# Altium project DAL_OBC_V10.PrjPcb (part 9 of 9)

## Sheet FPGA_CONN_OUT.SchDoc
size 420 x 297 mm; SheetNumber: 31; SheetTotal: 34
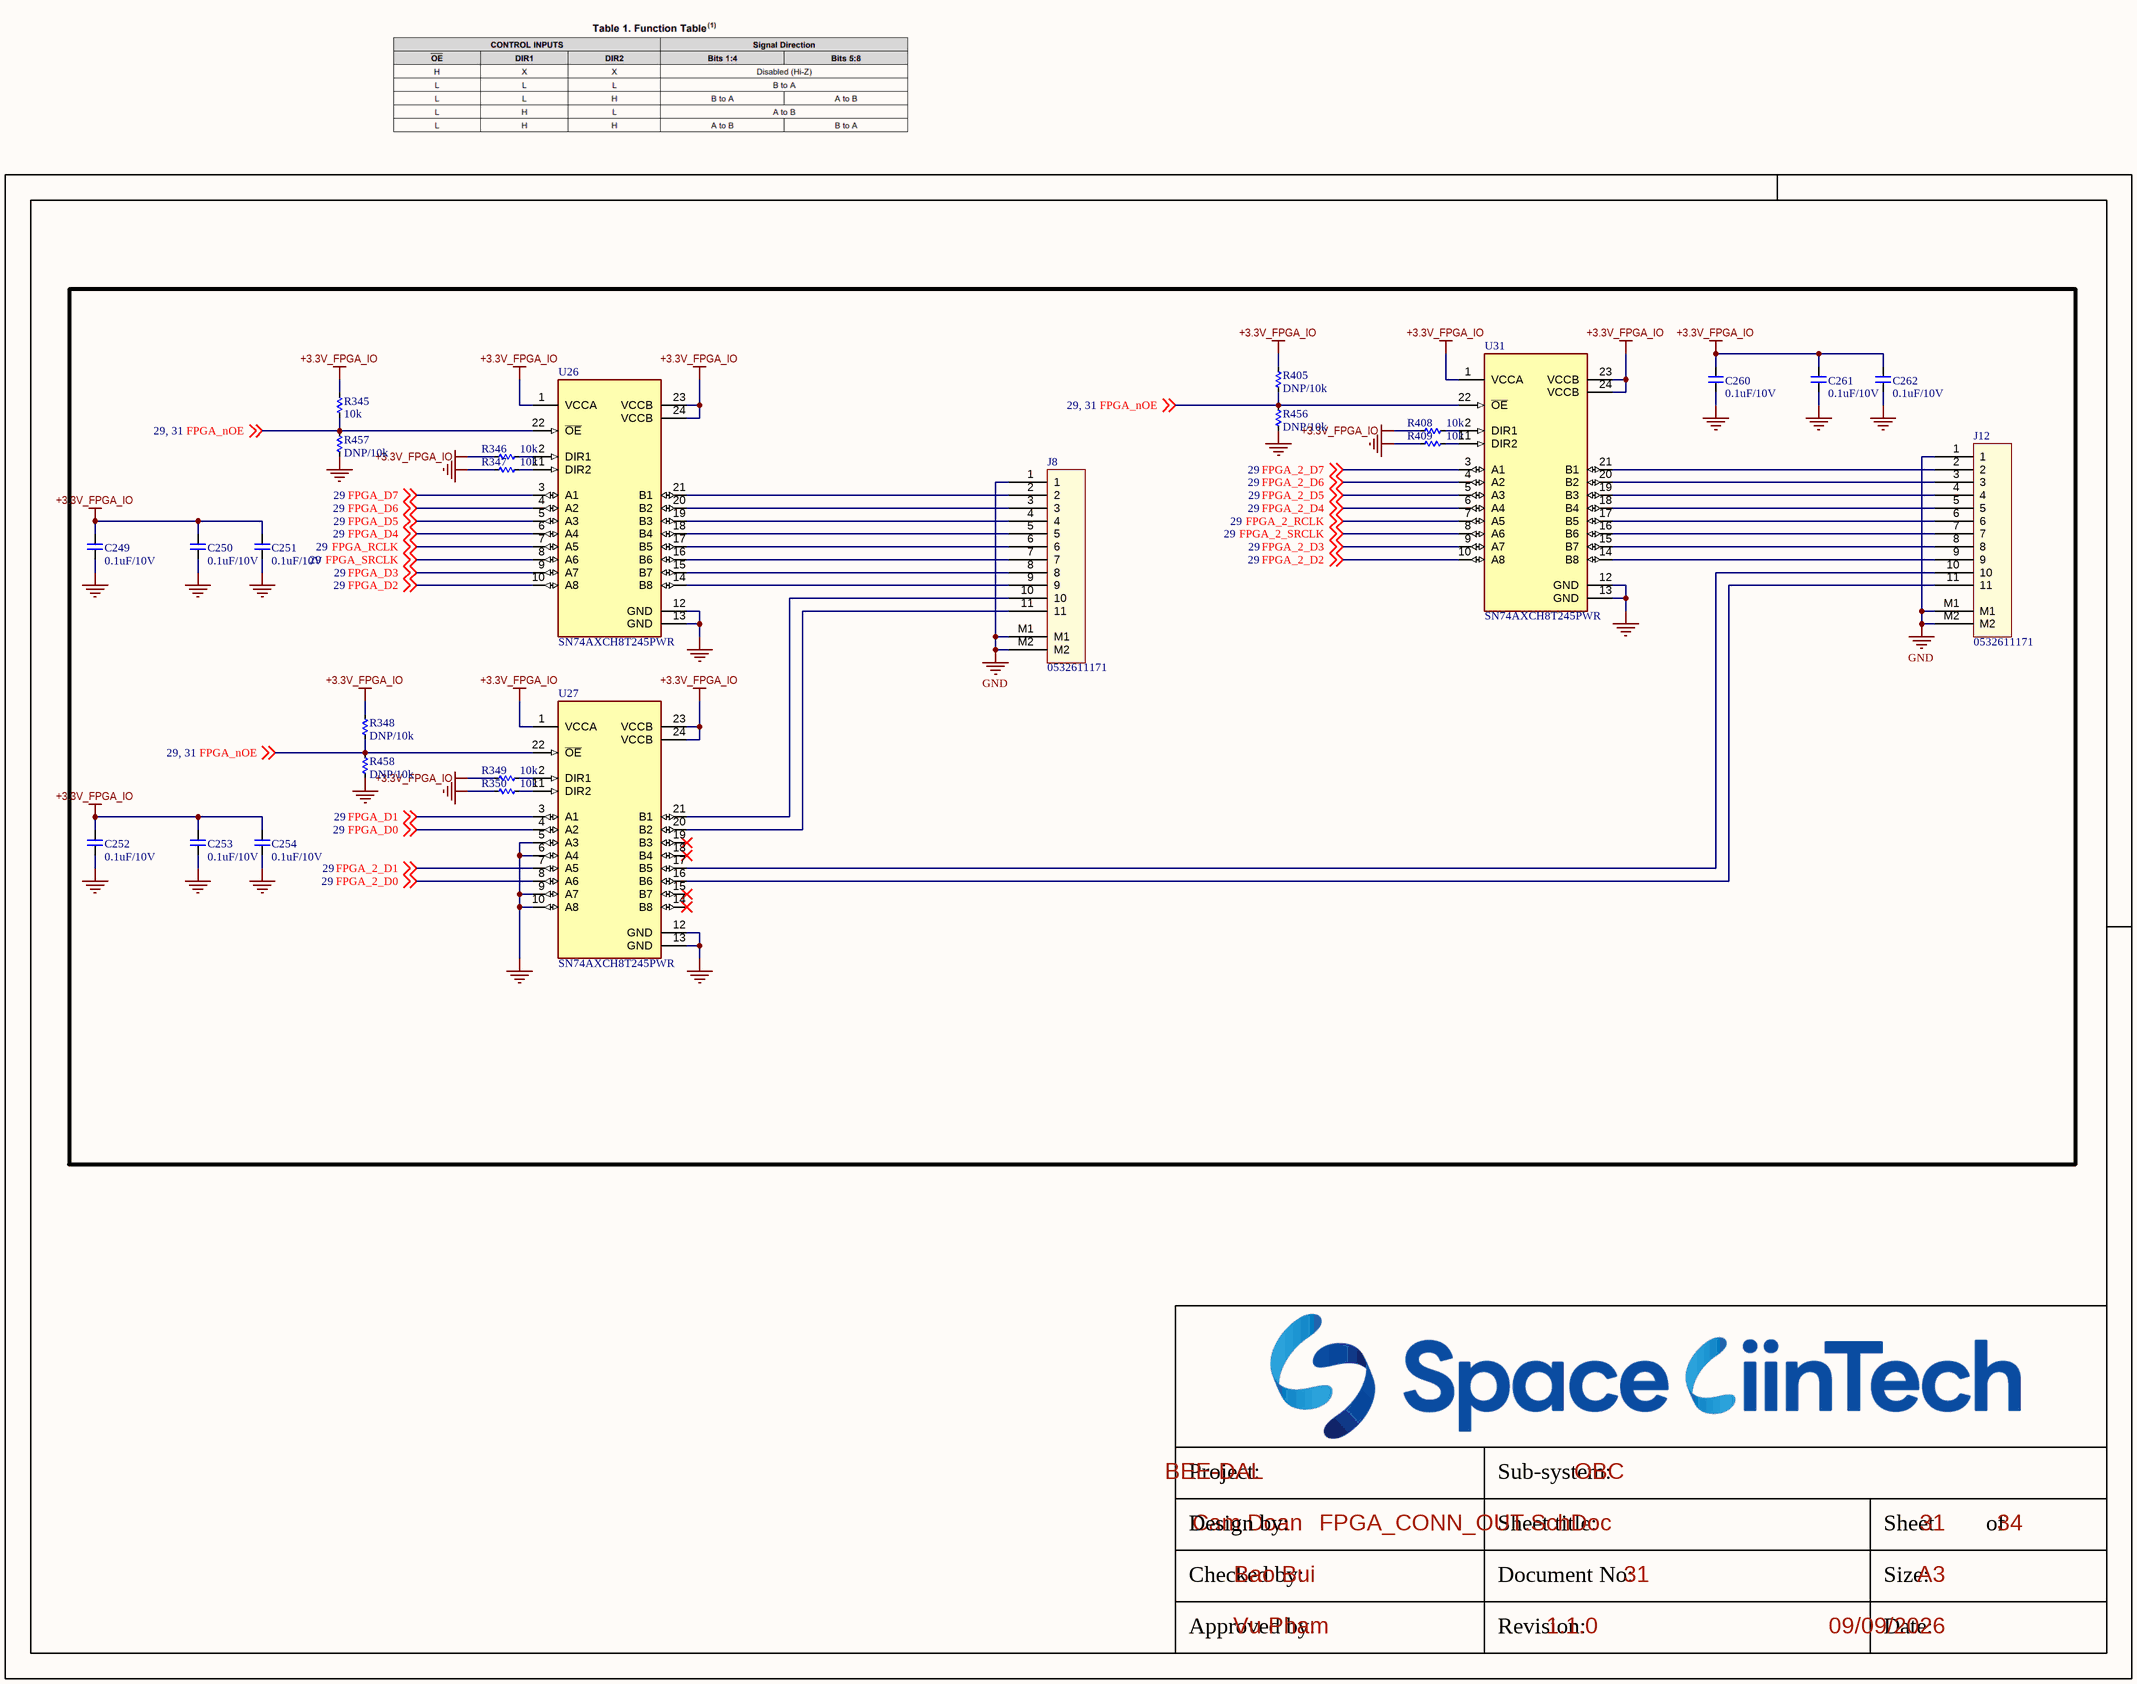
[diagram p32: FPGA_CONN_OUT.SchDoc]

### Parts
C249  0.1uF/10V  [CAP_C_1005X50_L]
C250  0.1uF/10V  [CAP_C_1005X50_L]
C251  0.1uF/10V  [CAP_C_1005X50_L]
C252  0.1uF/10V  [CAP_C_1005X50_L]
C253  0.1uF/10V  [CAP_C_1005X50_L]
C254  0.1uF/10V  [CAP_C_1005X50_L]
C260  0.1uF/10V  [CAP_C_1005X50_L]
C261  0.1uF/10V  [CAP_C_1005X50_L]
C262  0.1uF/10V  [CAP_C_1005X50_L]
J8  0532611171  [MOLEX_0532611171]
J12  0532611171  [MOLEX_0532611171]
R345  10k  [RES_C_1005x30_L]
R346  10k  [RES_C_1005x30_L]
R347  10k  [RES_C_1005x30_L]
R348  DNP/10k  [RES_C_1005x30_L]
R349  10k  [RES_C_1005x30_L]
R350  10k  [RES_C_1005x30_L]
R405  DNP/10k  [RES_C_1005x30_L]
R408  10k  [RES_C_1005x30_L]
R409  10k  [RES_C_1005x30_L]
R456  DNP/10k  [RES_C_1005x30_L]
R457  DNP/10k  [RES_C_1005x30_L]
R458  DNP/10k  [RES_C_1005x30_L]
U26  SN74AXCH8T245PWR  [SOP65P640X120-24N]
U27  SN74AXCH8T245PWR  [SOP65P640X120-24N]
U31  SN74AXCH8T245PWR  [SOP65P640X120-24N]

### Nets
+3.3V_FPGA_IO: C249.2 C250.2 C251.2 C252.2 C253.2 C254.2 C260.2 C261.2 C262.2 R345.1 R346.1 R348.1 R349.1 R405.1 R408.1 U26.1(VCCA) U26.23(VCCB) U26.24(VCCB) U27.1(VCCA) U27.23(VCCB) U27.24(VCCB) U31.1(VCCA) U31.23(VCCB) U31.24(VCCB)
GND: C249.1 C250.1 C251.1 C252.1 C253.1 C254.1 C260.1 C261.1 C262.1 J8.1 J8.M1 J8.M2 J12.1 J12.M1 J12.M2 R347.1 R350.1 R409.1 R456.2 R457.2 R458.2 U26.12(GND) U26.13(GND) U27.5(A3) U27.6(A4) U27.9(A7) U27.10(A8) U27.12(GND) U27.13(GND) U31.12(GND) U31.13(GND)  [project net AGND]
FPGA_2_D0: U27.8(A6) ; off-sheet FPGA_2_D0
FPGA_2_D1: U27.7(A5) ; off-sheet FPGA_2_D1
FPGA_2_D2: U31.10(A8) ; off-sheet FPGA_2_D2
FPGA_2_D3: U31.9(A7) ; off-sheet FPGA_2_D3
FPGA_2_D4: U31.6(A4) ; off-sheet FPGA_2_D4
FPGA_2_D5: U31.5(A3) ; off-sheet FPGA_2_D5
FPGA_2_D6: U31.4(A2) ; off-sheet FPGA_2_D6
FPGA_2_D7: U31.3(A1) ; off-sheet FPGA_2_D7
FPGA_2_RCLK: U31.7(A5) ; off-sheet FPGA_2_RCLK
FPGA_2_SRCLK: U31.8(A6) ; off-sheet FPGA_2_SRCLK
FPGA_D0: U27.4(A2) ; off-sheet FPGA_D0
FPGA_D1: U27.3(A1) ; off-sheet FPGA_D1
FPGA_D2: U26.10(A8) ; off-sheet FPGA_D2
FPGA_D3: U26.9(A7) ; off-sheet FPGA_D3
FPGA_D4: U26.6(A4) ; off-sheet FPGA_D4
FPGA_D5: U26.5(A3) ; off-sheet FPGA_D5
FPGA_D6: U26.4(A2) ; off-sheet FPGA_D6
FPGA_D7: U26.3(A1) ; off-sheet FPGA_D7
FPGA_nOE: R345.2 R348.2 R405.2 R456.1 R457.1 R458.1 U26.22(~{OE}) U27.22(~{OE}) U31.22(~{OE}) ; off-sheet FPGA_nOE
FPGA_RCLK: U26.7(A5) ; off-sheet FPGA_RCLK
FPGA_SRCLK: U26.8(A6) ; off-sheet FPGA_SRCLK
NetJ8_2: J8.2 U26.21(B1)
NetJ8_3: J8.3 U26.20(B2)
NetJ8_4: J8.4 U26.19(B3)
NetJ8_5: J8.5 U26.18(B4)
NetJ8_6: J8.6 U26.17(B5)
NetJ8_7: J8.7 U26.16(B6)
NetJ8_8: J8.8 U26.15(B7)
NetJ8_9: J8.9 U26.14(B8)
NetJ8_10: J8.10 U27.21(B1)
NetJ8_11: J8.11 U27.20(B2)
NetJ12_2: J12.2 U31.21(B1)
NetJ12_3: J12.3 U31.20(B2)
NetJ12_4: J12.4 U31.19(B3)
NetJ12_5: J12.5 U31.18(B4)
NetJ12_6: J12.6 U31.17(B5)
NetJ12_7: J12.7 U31.16(B6)
NetJ12_8: J12.8 U31.15(B7)
NetJ12_9: J12.9 U31.14(B8)
NetJ12_10: J12.10 U27.17(B5)
NetJ12_11: J12.11 U27.16(B6)
NetR346_2: R346.2 U26.2(DIR1)
NetR347_2: R347.2 U26.11(DIR2)
NetR349_2: R349.2 U27.2(DIR1)
NetR350_2: R350.2 U27.11(DIR2)
NetR408_2: R408.2 U31.2(DIR1)
NetR409_2: R409.2 U31.11(DIR2)

Not connected (* = marked no-connect by the designer): U27 14(B8)* 15(B7)* 18(B4)* 19(B3)*

### Notes on the sheet
- Project:
- Sub-system:
- Design by:
- Sheet title:
- Sheet
- of
- Checked by:
- Approved by:
- Revision:
- Document No:
- Size:
- Date:
- A3

### Library data of the parts
C249-C254 C260-C262 = _CAP_C_2: CAP
J8 J12 = Header 11x1_2M
R345-R350 R405 R408 R409 R456-R458 = _RES_B_2: RES
U26 U27 U31 = IC_voltage_level_SN74AXCH8T245PWR: 8-Bit Dual-Supply Bus Transceiver; MF: Texas Instruments; MP: SN74AXCH8T245PWR; Value: *; Check_prices: https://www.snapeda.com/parts/SN74AXCH8T245PWR/Texas+Instruments/view-part/?ref=eda; SnapEDA_Link: https://www.snapeda.com/parts/SN74AXCH8T245PWR/Texas+Instruments/view-part/?ref=snap; Price: None; Availability: In Stock; Purchase-URL: https://pricing.snapeda.com/search/part/SN74AXCH8T245PWR/?ref=eda; Package: TSSOP-24 Texas Instruments

## Sheet ChangeNote.SchDoc
size 420 x 297 mm; SheetNumber: 32; SheetTotal: 34

### Notes on the sheet
- Project:
- Sub-system:
- Design by:
- Sheet title:
- Sheet
- of
- Checked by:
- Approved by:
- Revision:
- Document No:
- Size:
- Date:
- A3

## Sheet MIPI_CSI.SchDoc
size 420 x 297 mm; SheetNumber: 33; SheetTotal: 34
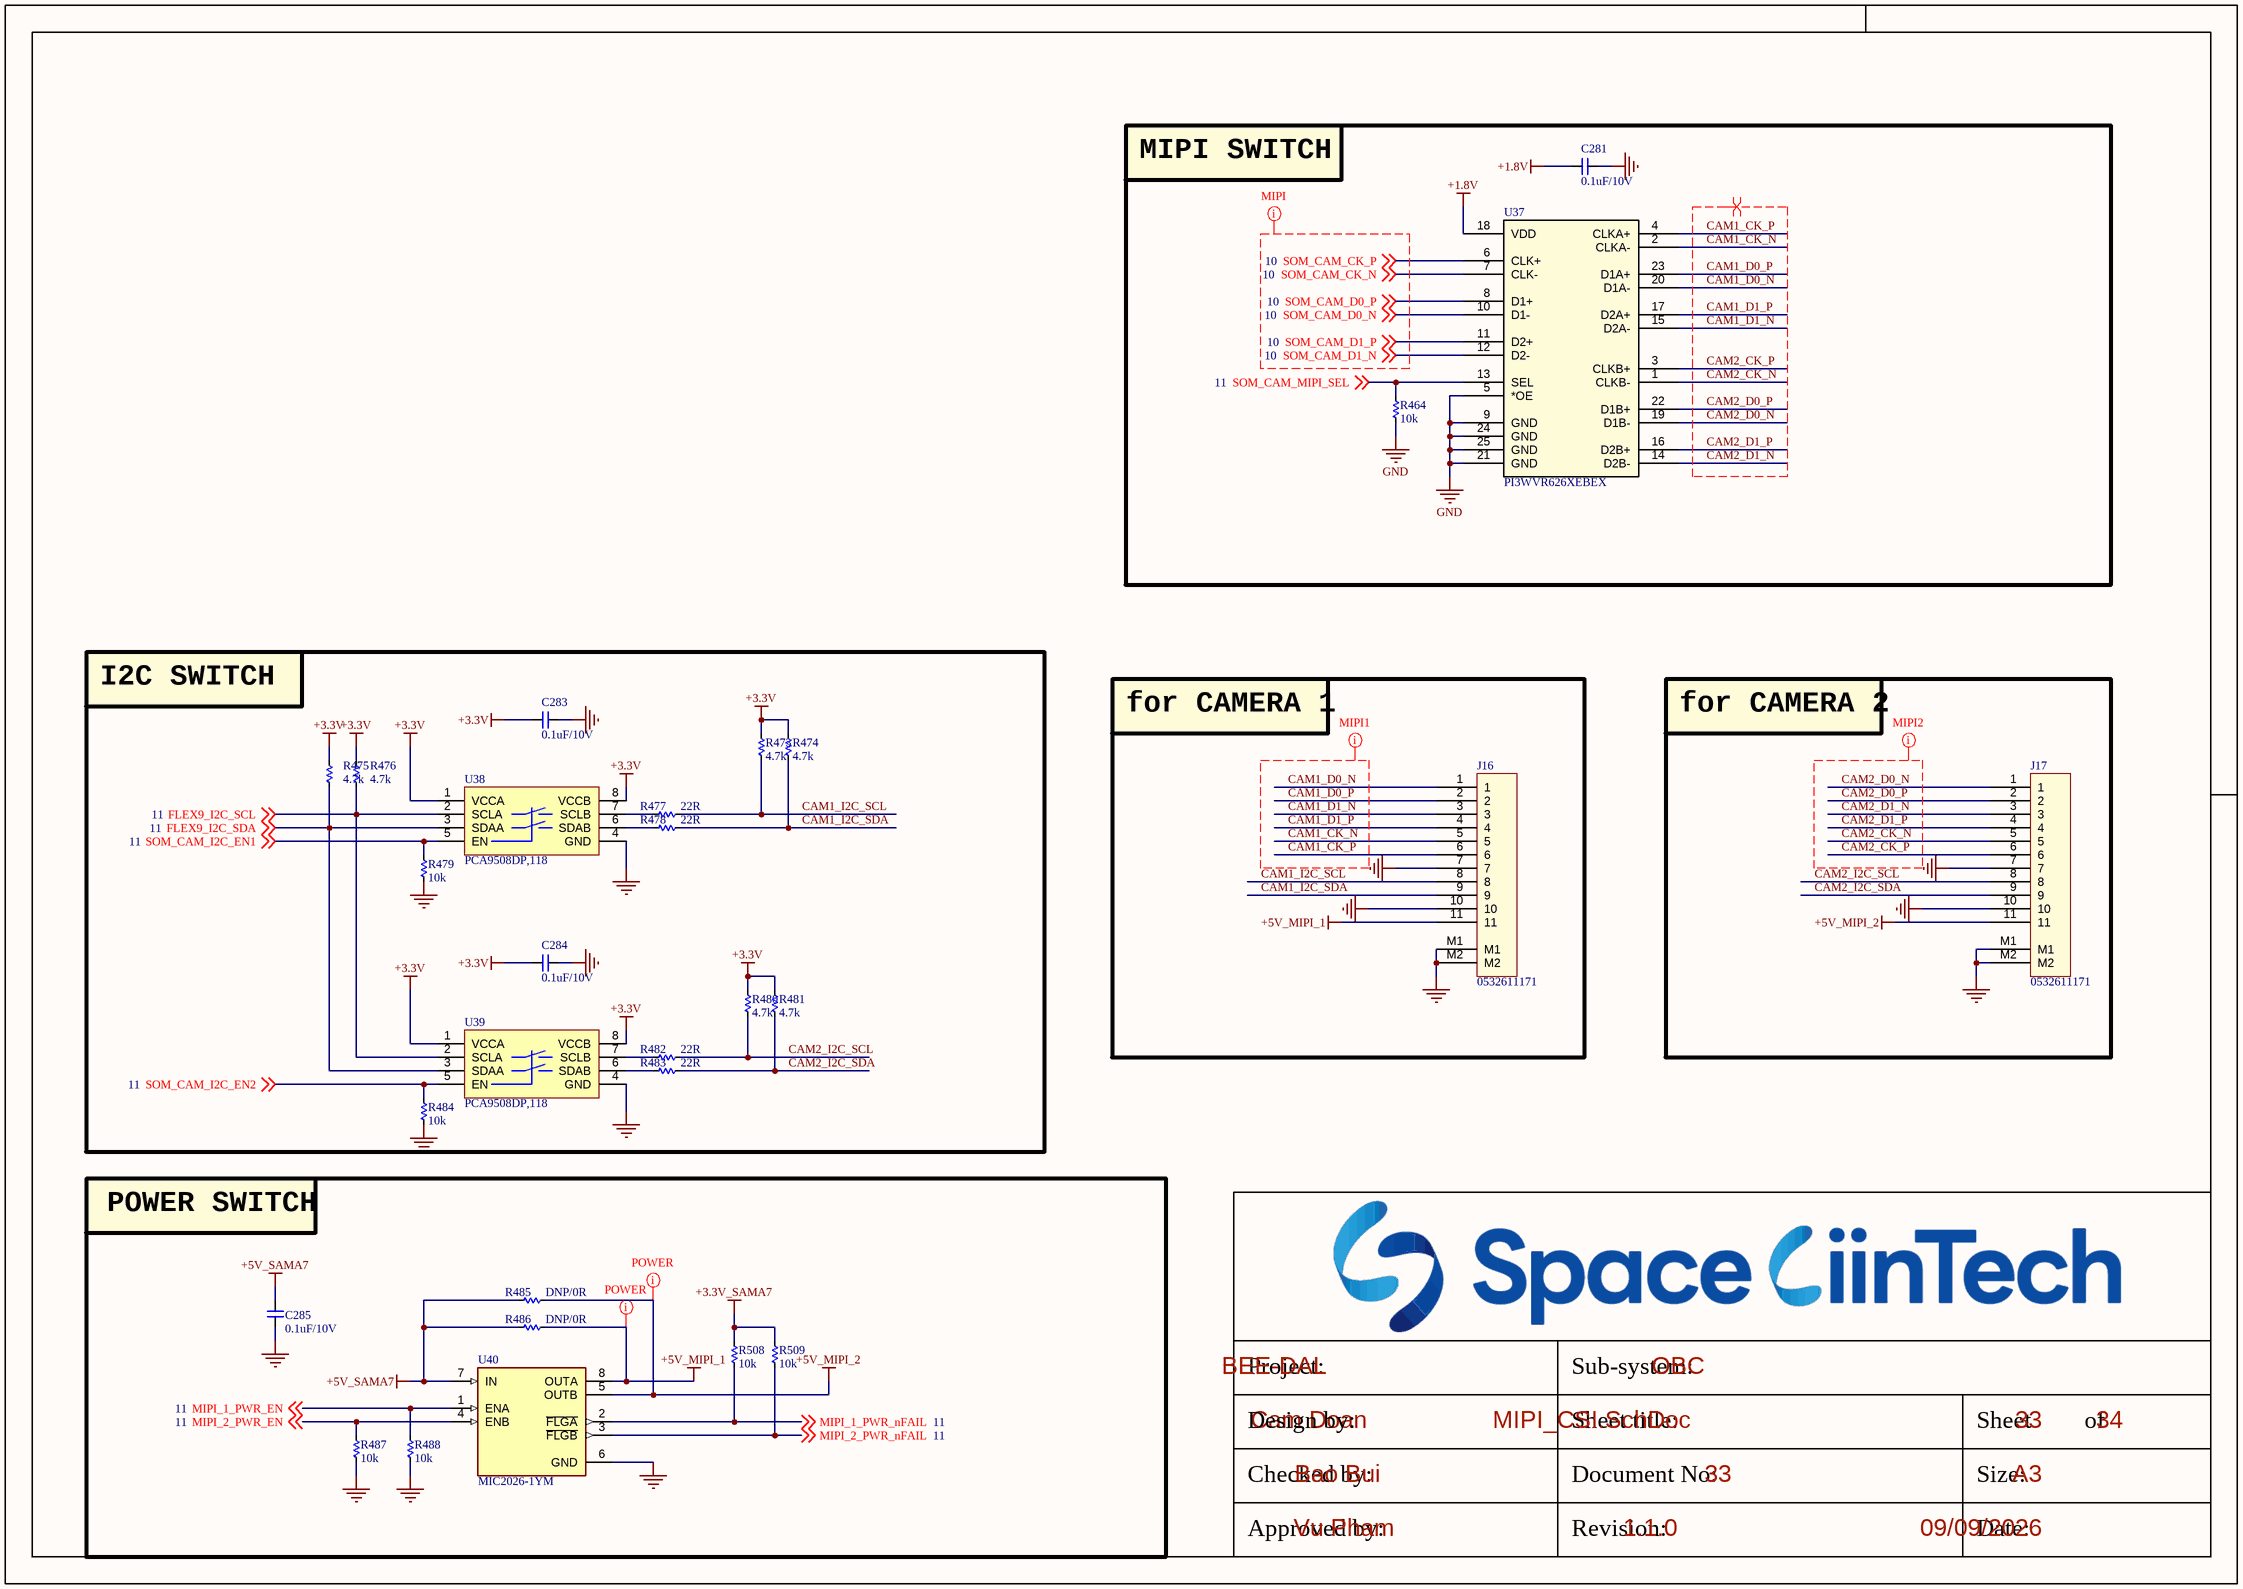
[diagram p33: MIPI_CSI.SchDoc]

### Parts
C281  0.1uF/10V  [CAP_C_1005X50_L]
C283  0.1uF/10V  [CAP_C_1005X50_L]
C284  0.1uF/10V  [CAP_C_1005X50_L]
C285  0.1uF/10V  [CAP_C_1005X50_L]
J16  0532611171  [MOLEX_0532611171]
J17  0532611171  [MOLEX_0532611171]
R464  10k  [RES_C_1005X40]
R473  4.7k  [RES_C_1005X40]
R474  4.7k  [RES_C_1005X40]
R475  4.7k  [RES_C_1005X40]
R476  4.7k  [RES_C_1005X40]
R477  22R  [RES_C_1005X40]
R478  22R  [RES_C_1005X40]
R479  10k  [RES_C_1005X40]
R480  4.7k  [RES_C_1005X40]
R481  4.7k  [RES_C_1005X40]
R482  22R  [RES_C_1005X40]
R483  22R  [RES_C_1005X40]
R484  10k  [RES_C_1005X40]
R485  DNP/0R  [RES_C_1005X40]
R486  DNP/0R  [RES_C_1005X40]
R487  10k  [RES_C_1005X40]
R488  10k  [RES_C_1005X40]
R508  10k  [RES_C_1005X40]
R509  10k  [RES_C_1005X40]
U37  PI3WVR626XEBEX  [PI3WVR626XEBEX_DIO]
U38  PCA9508DP,118  [TSOP8]
U39  PCA9508DP,118  [TSOP8]
U40  MIC2026-1YM  [SOIC127P602X173-8N]

### Blocks framed on the sheet
MIPI SWITCH: C281 R464 U37
I2C SWITCH: C283 C284 R473-R484 U38 U39
for CAMERA 1: J16
for CAMERA 2: J17
POWER SWITCH: C285 R485-R488 R508 R509 U40

### Nets
+1.8V: C281.2 U37.18(VDD)
+3.3V: C283.2 C284.2 R473.1 R474.1 R475.1 R476.1 R480.1 R481.1 U38.1(VCCA) U38.8(VCCB) U39.1(VCCA) U39.8(VCCB)
+3.3V_SAMA7: R508.1 R509.1
+5V_MIPI_1: J16.11 R486.1 U40.8(OUTA)
+5V_MIPI_2: J17.11 R485.1 U40.5(OUTB)
+5V_SAMA7: C285.2 R485.2 R486.2 U40.7(IN)
GND: C281.1 C283.1 C284.1 C285.1 J16.7 J16.10 J16.M1 J16.M2 J17.7 J17.10 J17.M1 J17.M2 R464.1 R479.2 R484.2 R487.2 R488.2 U37.5(*OE) U37.9(GND) U37.21(GND) U37.24(GND) U37.25(GND) U38.4(GND) U39.4(GND) U40.6(GND)  [project net AGND]
CAM1_CK_N: J16.5 U37.2(CLKA-)
CAM1_CK_P: J16.6 U37.4(CLKA+)
CAM1_D0_N: J16.1 U37.20(D1A-)
CAM1_D0_P: J16.2 U37.23(D1A+)
CAM1_D1_N: J16.3 U37.15(D2A-)
CAM1_D1_P: J16.4 U37.17(D2A+)
CAM1_I2C_SCL: J16.8 R473.2 R477.2
CAM1_I2C_SDA: J16.9 R474.2 R478.2
CAM2_CK_N: J17.5 U37.1(CLKB-)
CAM2_CK_P: J17.6 U37.3(CLKB+)
CAM2_D0_N: J17.1 U37.19(D1B-)
CAM2_D0_P: J17.2 U37.22(D1B+)
CAM2_D1_N: J17.3 U37.14(D2B-)
CAM2_D1_P: J17.4 U37.16(D2B+)
CAM2_I2C_SCL: J17.8 R480.2 R482.2
CAM2_I2C_SDA: J17.9 R481.2 R483.2
FLEX9_I2C_SCL: R476.2 U38.2(SCLA) U39.2(SCLA) ; off-sheet FLEX9_I2C_SCL
FLEX9_I2C_SDA: R475.2 U38.3(SDAA) U39.3(SDAA) ; off-sheet FLEX9_I2C_SDA
MIPI_1_PWR_EN: R488.1 U40.1(ENA) ; off-sheet MIPI_1_PWR_EN
MIPI_1_PWR_nFAIL: R508.2 U40.2(~{FLGA}) ; off-sheet MIPI_1_PWR_nFAIL
MIPI_2_PWR_EN: R487.1 U40.4(ENB) ; off-sheet MIPI_2_PWR_EN
MIPI_2_PWR_nFAIL: R509.2 U40.3(~{FLGB}) ; off-sheet MIPI_2_PWR_nFAIL
SOM_CAM_CK_N: U37.7(CLK-) ; off-sheet SOM_CAM_CK_N  [project net MIPI_CK_N]
SOM_CAM_CK_P: U37.6(CLK+) ; off-sheet SOM_CAM_CK_P  [project net MIPI_CK_P]
SOM_CAM_D0_N: U37.10(D1-) ; off-sheet SOM_CAM_D0_N  [project net MIPI_D0_N]
SOM_CAM_D0_P: U37.8(D1+) ; off-sheet SOM_CAM_D0_P  [project net MIPI_D0_P]
SOM_CAM_D1_N: U37.12(D2-) ; off-sheet SOM_CAM_D1_N  [project net MIPI_D1_N]
SOM_CAM_D1_P: U37.11(D2+) ; off-sheet SOM_CAM_D1_P  [project net MIPI_D1_P]
SOM_CAM_I2C_EN1: R479.1 U38.5(EN) ; off-sheet SOM_CAM_I2C_EN1
SOM_CAM_I2C_EN2: R484.1 U39.5(EN) ; off-sheet SOM_CAM_I2C_EN2
SOM_CAM_MIPI_SEL: R464.2 U37.13(SEL) ; off-sheet SOM_CAM_MIPI_SEL
NetR477_1: R477.1 U38.7(SCLB)
NetR478_1: R478.1 U38.6(SDAB)
NetR482_1: R482.1 U39.7(SCLB)
NetR483_1: R483.1 U39.6(SDAB)

### Layout directives
differential pair; net class DIFF100; differential pair class DIFF100: CAM1_CK_N, CAM1_CK_P, CAM1_D0_N, CAM1_D0_P, CAM1_D1_N, CAM1_D1_P, CAM2_CK_N, CAM2_CK_P, CAM2_D0_N, CAM2_D0_P, CAM2_D1_N, CAM2_D1_P
net class POWER: +5V_MIPI_1, +5V_MIPI_2
net class MIPI: SOM_CAM_CK_N, SOM_CAM_CK_P, SOM_CAM_D0_N, SOM_CAM_D0_P, SOM_CAM_D1_N, SOM_CAM_D1_P
net class MIPI1: CAM1_CK_N, CAM1_CK_P, CAM1_D0_N, CAM1_D0_P, CAM1_D1_N, CAM1_D1_P
net class MIPI2: CAM2_CK_N, CAM2_CK_P, CAM2_D0_N, CAM2_D0_P, CAM2_D1_N, CAM2_D1_P

### Notes on the sheet
- Project:
- Sub-system:
- Design by:
- Sheet title:
- Sheet
- of
- Checked by:
- Approved by:
- Revision:
- Document No:
- Size:
- Date:
- A3

### Library data of the parts
C281 C283 C284 = _CAP_C_2: CAP CHIP
C285 = _CAP_C_2: CAP
J16 J17 = Header 11x1_2M
R464 R473-R488 R508 R509 = _RES_B_2: RES
U37 = PI3WVR626XEBEX: Mfr_Name: Diodes Inc; RefDes: RefDes; Type: Type
U40 = IC_PWRSW_MIC2026-1YM: Power Switch/Driver 1:2 N-Channel 1.25A 8-SOIC; MF: Microchip; SnapEDA_Link: https://www.snapeda.com/parts/MIC2026-1YM/Microchip/view-part/?ref=snap; Package: SO-8 Microchip; Value: *; MP: MIC2026-1YM; Check_prices: https://www.snapeda.com/parts/MIC2026-1YM/Microchip/view-part/?ref=eda

## Sheet NTC.SchDoc
size 420 x 297 mm; SheetNumber: 34; SheetTotal: 34
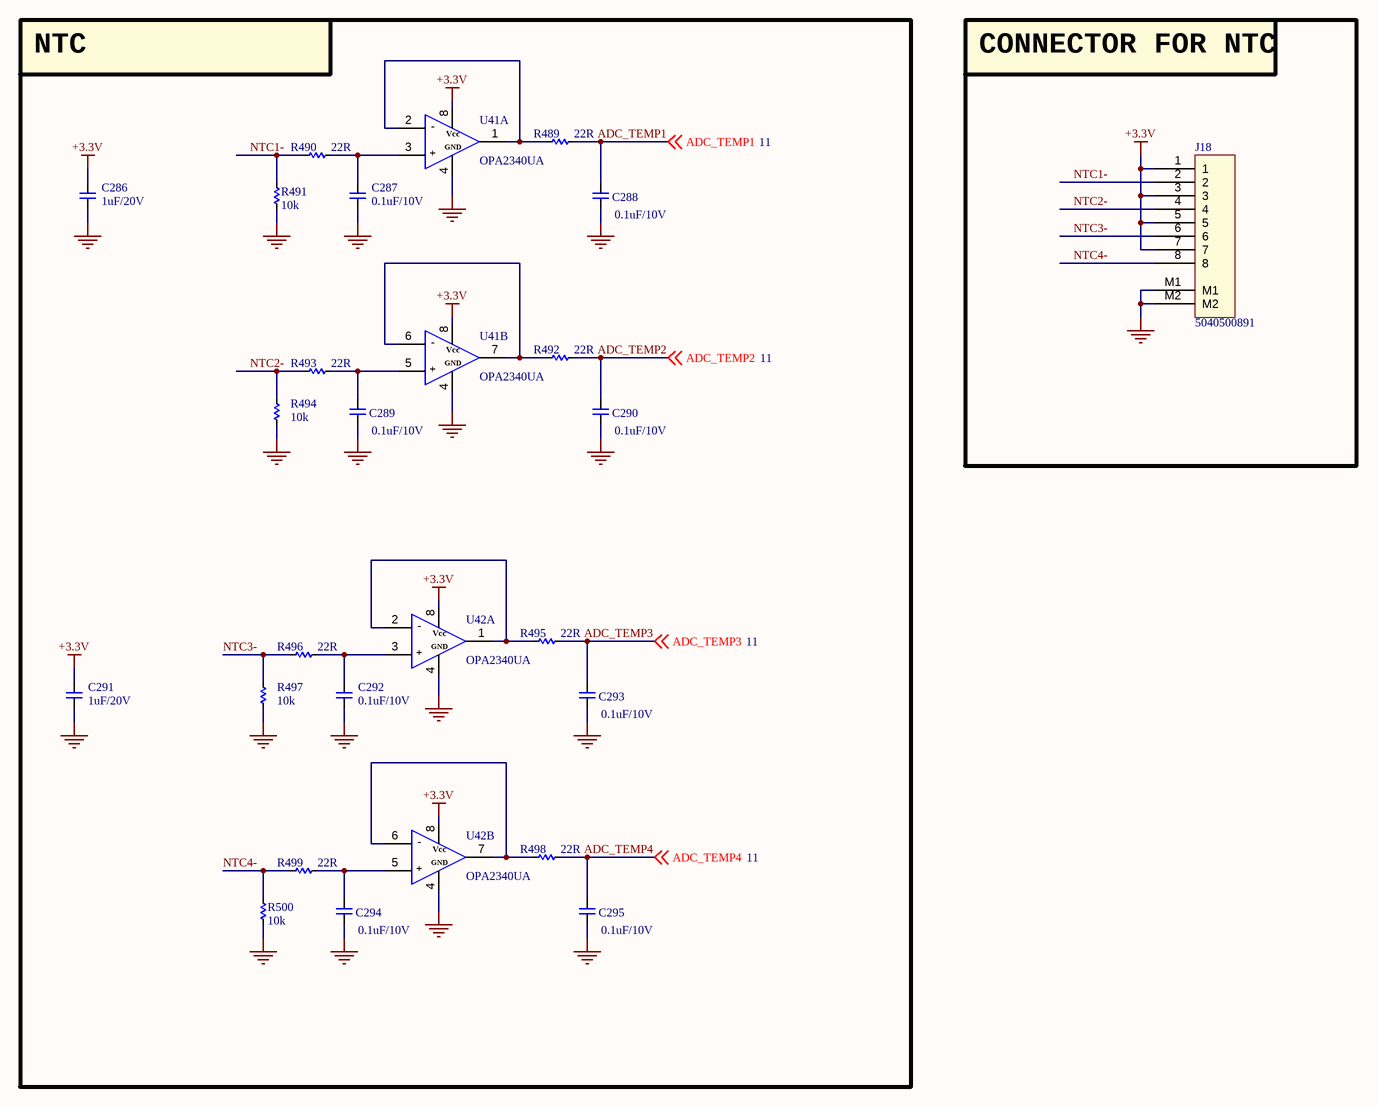
[diagram p34: NTC.SchDoc]

### Parts
C286  1uF/20V  [CAP_C_1005X60]
C287  0.1uF/10V  [CAP_C_1005X50_L]
C288  0.1uF/10V  [CAP_C_1005X50_L]
C289  0.1uF/10V  [CAP_C_1005X50_L]
C290  0.1uF/10V  [CAP_C_1005X50_L]
C291  1uF/20V  [CAP_C_1005X60]
C292  0.1uF/10V  [CAP_C_1005X50_L]
C293  0.1uF/10V  [CAP_C_1005X50_L]
C294  0.1uF/10V  [CAP_C_1005X50_L]
C295  0.1uF/10V  [CAP_C_1005X50_L]
J18  5040500891  [MOLEX_5040500891]
R489  22R  [RES_C_1005X40]
R490  22R  [RES_C_1005X40]
R491  10k  [RES_C_1005X40]
R492  22R  [RES_C_1005X40]
R493  22R  [RES_C_1005X40]
R494  10k  [RES_C_1005X40]
R495  22R  [RES_C_1005X40]
R496  22R  [RES_C_1005X40]
R497  10k  [RES_C_1005X40]
R498  22R  [RES_C_1005X40]
R499  22R  [RES_C_1005X40]
R500  10k  [RES_C_1005X40]
U41  OPA2340UA  [SOIC127P602X173-8N]  (parts A,B of 2)
U42  OPA2340UA  [SOIC127P602X173-8N]  (parts A,B of 2)

### Blocks framed on the sheet
NTC: C286-C295 R489-R500 U41 U42
CONNECTOR FOR NTC: J18

### Nets
+3.3V: C286.2 C291.2 J18.1 J18.3 J18.5 J18.7 U41.8 U42.8
GND: C286.1 C287.1 C288.1 C289.1 C290.1 C291.1 C292.1 C293.1 C294.1 C295.1 J18.M1 J18.M2 R491.1 R494.1 R497.1 R500.1 U41.4 U42.4  [project net AGND]
ADC_TEMP1: C288.2 R489.2 ; off-sheet ADC_TEMP1
ADC_TEMP2: C290.2 R492.2 ; off-sheet ADC_TEMP2
ADC_TEMP3: C293.2 R495.2 ; off-sheet ADC_TEMP3
ADC_TEMP4: C295.2 R498.2 ; off-sheet ADC_TEMP4
NTC1-: J18.2 R490.1 R491.2
NTC2-: J18.4 R493.1 R494.2
NTC3-: J18.6 R496.1 R497.2
NTC4-: J18.8 R499.1 R500.2
NetC287_2: C287.2 R490.2 U41.3
NetC289_2: C289.2 R493.2 U41.5
NetC292_2: C292.2 R496.2 U42.3
NetC294_2: C294.2 R499.2 U42.5
NetR489_1: R489.1 U41.1 U41.2
NetR492_1: R492.1 U41.6 U41.7
NetR495_1: R495.1 U42.1 U42.2
NetR498_1: R498.1 U42.6 U42.7

### Notes on the sheet
- Project:
- Sub-system:
- Design by:
- Sheet title:
- Sheet
- of
- Checked by:
- Approved by:
- Revision:
- Document No:
- Size:
- Date:
- A3
- (in symbol OPA2340UA, part A) -; Vcc; GND; +
- (in symbol OPA2340UA, part B) -; Vcc; GND; +

### Library data of the parts
C286-C295 = _CAP_C_2: CAP
J18 = Header 8x1_2M
R489-R500 = _RES_B_2: RES

## Nets that join several sheets
3.3_VBAT: SAMA7G54_MPU (R34.1), RTC (5 pins)
+1.8V: Power (C300.1 U44.5), MIPI_CSI (C281.2 U37.18)
+1.8V_FPGA: FPGA_POWER (6 pins), FPGA_POWER_2 (13 pins)
+1V_FPGA: FPGA_POWER (6 pins), FPGA_POWER_2 (18 pins)
+3.3V: Power (C299.1 R518.2 U44.1), POWER_MANAGER (R103.2), CONNECTOR_BUS (C298.2 R512.1 R513.1 U43.1), DEBUG_CONSOLE (6 pins), TEMP (C139.2 U12.1), RTC (13 pins), WATCHDOG (C155.2 U16.1), CAN_PHY (6 pins), RS485 (C180.2 R226.1 U28.8), RS422 (6 pins), RS232 (C141.2 U35.16), MIPI_CSI (12 pins), NTC (8 pins)
+3.3V_FPGA_IO: FPGA_POWER (9 pins), FPGA_POWER_2 (50 pins), FPGA_BANK (20 pins), FPGA_FLASH_EEPROM (20 pins), FPGA_CONN_OUT (24 pins)
+3.3V_SAMA7: Power (5 pins), CONNECTOR_IN (R316.2), USB_CAMERA (9 pins), MIPI_CSI (R508.1 R509.1)
+3.3V_SENSE: Power (5 pins), POWER_MANAGER (R103.1)
+5V_AI: POWER_MANAGER (R105.2), CONNECTOR_BUS (H2.19 H2.20)
+5V_AI_eFUSE: Power (8 pins), POWER_MANAGER (R105.1)
+5V_FPGA: POWER_MANAGER (R83.2), FPGA_POWER (11 pins)
+5V_FPGA_eFUSE: POWER_MANAGER (R83.1), FPGA_POWER (8 pins)
+5V_MASTER: Power (17 pins), FPGA_POWER (5 pins)
+5V_PC104: Power (5 pins), CONNECTOR_BUS (6 pins)
+5V_SAMA7: Power (5 pins), POWER_MANAGER (R81#1.2), SAMA7G54_PMIC (13 pins), SAMA7G54_PIO (R152.1), USB_CAMERA (JP7.2), DEBUG_CONSOLE (JP6.1), FPGA_POWER (R305.1), MIPI_CSI (C285.2 R485.2 R486.2 U40.7)
+5V_SAMA7_eFUSE: Power (8 pins), POWER_MANAGER (R81#1.1)
+12V_PC104: CONNECTOR_IN (7 pins), CONNECTOR_BUS (H2.23 H2.24)
AGND: Power (46 pins), POWER_MANAGER (6 pins), CONNECTOR_IN (16 pins), CONNECTOR_BUS (10 pins), SAMA7G54_PMIC (30 pins), SAMA7G54_MPU (115 pins), SAMA7G54_PIO (10 pins), SAMA7G54_DDR3L (84 pins), SDCARD_MRAM (13 pins), eMMC (30 pins), USB_CAMERA (46 pins), DEBUG_CONSOLE (13 pins), TEMP (C139.1 C140.1 U12.3), RTC (10 pins), WATCHDOG (C155.1 R216.2 R283.2 U16.2), CAN_PHY (9 pins), RS485 (C180.1 U28.5), RS422 (6 pins), RS232 (C141.1 C144.1 C145.1 U35.15), BUTTON_LED (DS4.1 DS5.1 DS6.1), MOUNTING_HOLE (Hole1.1 Hole2.1 Hole3.1 Hole4.1), FPGA_POWER (38 pins), FPGA_POWER_2 (77 pins), FPGA_BANK (25 pins), FPGA_FLASH_EEPROM (11 pins), FPGA_CONN_OUT (31 pins), MIPI_CSI (25 pins), NTC (18 pins)
VDD_3V3: POWER_MANAGER (11 pins), SAMA7G54_PMIC (18 pins), SAMA7G54_MPU (7 pins), SAMA7G54_PIO (8 pins), SDCARD_MRAM (18 pins), eMMC (38 pins)
VDD_3V3_MPU: SAMA7G54_PMIC (5 pins), SAMA7G54_MPU (36 pins)
VDDCORE: SAMA7G54_PMIC (R12.2 TP3.0), SAMA7G54_MPU (30 pins)
VDDCPU: SAMA7G54_PMIC (R15.2 TP5.0), SAMA7G54_MPU (11 pins)
VDDIODDR: SAMA7G54_PMIC (R18.2 TP10.0), SAMA7G54_DDR3L (73 pins)
_PD09: SAMA7G54_PMIC (R11.1 U1.1), SAMA7G54_PIO (U3.D19)
ADC_TEMP1: SAMA7G54_PIO (R273.1), NTC (C288.2 R489.2)
ADC_TEMP2: SAMA7G54_PIO (R138.1), NTC (C290.2 R492.2)
ADC_TEMP3: SAMA7G54_PIO (R274.1), NTC (C293.2 R495.2)
ADC_TEMP4: SAMA7G54_PIO (R275.1), NTC (C295.2 R498.2)
ADC_TEMP_1: SAMA7G54_PIO (R386.1), TEMP (C140.2 R195.2)
CPU_FPGA_PROGRAM_B: SAMA7G54_PIO (R315.1), FPGA_BANK (R357.1)
FLEX9_I2C_SCL: SAMA7G54_PIO (R142.1), MIPI_CSI (R476.2 U38.2 U39.2)
FLEX9_I2C_SDA: SAMA7G54_PIO (R140.1), MIPI_CSI (R475.2 U38.3 U39.3)
FPGA_2_D0: FPGA_BANK (R392.2), FPGA_CONN_OUT (U27.8)
FPGA_2_D1: FPGA_BANK (R393.2), FPGA_CONN_OUT (U27.7)
FPGA_2_D2: FPGA_BANK (R394.2), FPGA_CONN_OUT (U31.10)
FPGA_2_D3: FPGA_BANK (R395.2), FPGA_CONN_OUT (U31.9)
FPGA_2_D4: FPGA_BANK (R397.2), FPGA_CONN_OUT (U31.6)
FPGA_2_D5: FPGA_BANK (R399.2), FPGA_CONN_OUT (U31.5)
FPGA_2_D6: FPGA_BANK (R398.2), FPGA_CONN_OUT (U31.4)
FPGA_2_D7: FPGA_BANK (R400.2), FPGA_CONN_OUT (U31.3)
FPGA_2_RCLK: FPGA_BANK (R390.2), FPGA_CONN_OUT (U31.7)
FPGA_2_SRCLK: FPGA_BANK (R391.2), FPGA_CONN_OUT (U31.8)
FPGA_CONF_SPI_CLK: FPGA_BANK (R186.2), FPGA_FLASH_EEPROM (U14.6)
FPGA_CONF_SPI_CS: FPGA_BANK (R187.2), FPGA_FLASH_EEPROM (R252.1 U14.3)
FPGA_CONF_SPI_MISO: FPGA_BANK (R192.2), FPGA_FLASH_EEPROM (U14.13)
FPGA_CONF_SPI_MOSI: FPGA_BANK (R189.2), FPGA_FLASH_EEPROM (U14.10)
FPGA_D0: FPGA_BANK (R198.2), FPGA_CONN_OUT (U27.4)
FPGA_D1: FPGA_BANK (R199.2), FPGA_CONN_OUT (U27.3)
FPGA_D2: FPGA_BANK (R188.2), FPGA_CONN_OUT (U26.10)
FPGA_D3: FPGA_BANK (R190.2), FPGA_CONN_OUT (U26.9)
FPGA_D4: FPGA_BANK (R194.2), FPGA_CONN_OUT (U26.6)
FPGA_D5: FPGA_BANK (R196.2), FPGA_CONN_OUT (U26.5)
FPGA_D6: FPGA_BANK (R203.2), FPGA_CONN_OUT (U26.4)
FPGA_D7: FPGA_BANK (R205.2), FPGA_CONN_OUT (U26.3)
FPGA_FLASH_SPI_MCSN: FPGA_BANK (R197.2), FPGA_FLASH_EEPROM (R249.1 U13.3)
FPGA_FLASH_SPI_MD2: FPGA_BANK (R202.2), FPGA_FLASH_EEPROM (R266.1)
FPGA_FLASH_SPI_MD3: FPGA_BANK (R201.2), FPGA_FLASH_EEPROM (R265.2)
FPGA_FLASH_SPI_MISO/MD1: FPGA_BANK (R204.2), FPGA_FLASH_EEPROM (U13.13)
FPGA_FLASH_SPI_MOSI/MD0: FPGA_BANK (R206.2), FPGA_FLASH_EEPROM (U13.10)
FPGA_nOE: FPGA_BANK (R200.2), FPGA_CONN_OUT (9 pins)
FPGA_QSPI_CLK: FPGA_BANK (R243.2 R355.2), FPGA_FLASH_EEPROM (U13.6)
FPGA_RCLK: FPGA_BANK (R191.2), FPGA_CONN_OUT (U26.7)
FPGA_SRCLK: FPGA_BANK (R193.2), FPGA_CONN_OUT (U26.8)
FPGA_USART_CLK: SAMA7G54_PIO (R269.1), FPGA_BANK (U11.P8)
FPGA_USART_RX: SAMA7G54_PIO (R148.1), FPGA_BANK (U11.R8)
FPGA_USART_TX: SAMA7G54_PIO (R147.1), FPGA_BANK (U11.T7)
LPM: SAMA7G54_PMIC (Q1.1 R3.1 R401.1), SAMA7G54_MPU (R402.1)
MCP16502_HPM: SAMA7G54_PMIC (R4.1), SAMA7G54_PIO (R78.1 R152.2 R155.1)
MIPI_1_PWR_EN: SAMA7G54_PIO (R183.1), MIPI_CSI (R488.1 U40.1)
MIPI_1_PWR_nFAIL: SAMA7G54_PIO (R181.1), MIPI_CSI (R508.2 U40.2)
MIPI_2_PWR_EN: SAMA7G54_PIO (R184.1), MIPI_CSI (R487.1 U40.4)
MIPI_2_PWR_nFAIL: SAMA7G54_PIO (R294.1), MIPI_CSI (R509.2 U40.3)
MIPI_CK_N: SAMA7G54_MPU (U3.N20), MIPI_CSI (U37.7)
MIPI_CK_P: SAMA7G54_MPU (U3.N21), MIPI_CSI (U37.6)
MIPI_D0_N: SAMA7G54_MPU (U3.R18), MIPI_CSI (U37.10)
MIPI_D0_P: SAMA7G54_MPU (U3.P18), MIPI_CSI (U37.8)
MIPI_D1_N: SAMA7G54_MPU (U3.R20), MIPI_CSI (U37.12)
MIPI_D1_P: SAMA7G54_MPU (U3.R21), MIPI_CSI (U37.11)
MPU_CANRX0: SAMA7G54_PIO (R127.1), CAN_PHY (U21.4)
MPU_CANRX1: SAMA7G54_PIO (R132.1), CAN_PHY (U22.4)
MPU_CANTX0: SAMA7G54_PIO (R125.1), CAN_PHY (U21.1)
MPU_CANTX1: SAMA7G54_PIO (R130.1), CAN_PHY (U22.1)
MPU_FPGA_IO_0: SAMA7G54_PIO (R370.1), FPGA_BANK (R374.2)
MPU_FPGA_IO_1: SAMA7G54_PIO (R371.1), FPGA_BANK (R375.2)
MPU_FPGA_IO_2: SAMA7G54_PIO (R372.1), FPGA_BANK (R376.2)
MPU_FPGA_IO_3: SAMA7G54_PIO (R373.1), FPGA_BANK (R377.2)
MPU_UART_CONSOLE_RX: SAMA7G54_PIO (R137.1), DEBUG_CONSOLE (J4.3 R281.2 U19.1)
MPU_UART_CONSOLE_TX: SAMA7G54_PIO (R135.1), DEBUG_CONSOLE (J4.2 R282.2 U19.12)
MPU_UART_RS422_RX: SAMA7G54_PIO (R151.1), DEBUG_CONSOLE (U19.5)
MPU_UART_RS422_TX: SAMA7G54_PIO (R149.1), DEBUG_CONSOLE (U19.14)
MPU_USB_LED: SAMA7G54_PIO (R82.1), USB_CAMERA (R419.1 R423.1 R428.1 R431.1)
MPU_USBA_N: SAMA7G54_MPU (U3.B3), DEBUG_CONSOLE (D6.1)
MPU_USBA_P: SAMA7G54_MPU (U3.A3), DEBUG_CONSOLE (D6.3)
MPU_USBB_N: CONNECTOR_BUS (H1.02), SAMA7G54_MPU (U3.B4)
MPU_USBB_P: CONNECTOR_BUS (H1.04), SAMA7G54_MPU (U3.A4)
MPU_USBC_N: SAMA7G54_MPU (U3.B6), USB_CAMERA (U32.3)
MPU_USBC_P: SAMA7G54_MPU (U3.A6), USB_CAMERA (U32.2)
NetC72_1: SAMA7G54_PMIC (U1.24), SAMA7G54_MPU (C72.1 JP3.1)
NetC75_2: SAMA7G54_PMIC (R10.1 U1.2), SAMA7G54_MPU (R37.1 U3.J7), SAMA7G54_PIO (C75.2 R154.1), WATCHDOG (R213.2)
NetH1_21: CONNECTOR_BUS (H1.21), SAMA7G54_PIO (R42.1)
NetH1_22: CONNECTOR_BUS (H1.22), SAMA7G54_PIO (R270.1)
NetH1_23: CONNECTOR_BUS (H1.23), SAMA7G54_PIO (R101.1)
NetH1_25: CONNECTOR_BUS (H1.25), SAMA7G54_PIO (R47.1)
NetH1_27: CONNECTOR_BUS (H1.27), SAMA7G54_PIO (R45.1)
NetH1_37: CONNECTOR_BUS (H1.37), RS485 (R228.1 U28.7)
NetH1_38: CONNECTOR_BUS (H1.38), RS485 (R228.2 U28.6)
NetQ1_3: SAMA7G54_PMIC (Q1.3 R16.2), SAMA7G54_MPU (Y2.1)
NetR7_2: SAMA7G54_PMIC (R7.2 U2.1), SAMA7G54_PIO (R118.1)
NetR48_1: SAMA7G54_PIO (R48.1), RS485 (U28.4)
NetR51_1: SAMA7G54_PIO (R51.1), RS485 (U28.1)
NetR64_1: SAMA7G54_PIO (R64.1), RTC (R209.2 U15.7)
NetR67_1: SAMA7G54_PIO (R67.1), WATCHDOG (R214.2)
NetR79_2: POWER_MANAGER (R79.2 U6.1), SAMA7G54_PIO (R396.1)
NetR111_1: SAMA7G54_PIO (R111.1), WATCHDOG (R215.2)
NetR116_1: SAMA7G54_PIO (R116.1), RTC (R208.2 U15.3)
NetR226_2: SAMA7G54_PIO (R268.1), RS485 (R226.2 U28.2 U28.3)
PC104_CAM_IQR1: CONNECTOR_BUS (H1.47), SAMA7G54_PIO (R271.1)
PC104_CAM_IQR2: CONNECTOR_BUS (H1.49), SAMA7G54_PIO (R272.1)
PC104_CAN_H: CONNECTOR_BUS (H1.03), CAN_PHY (JP13.2 U21.7 U22.7)
PC104_CAN_L: CONNECTOR_BUS (H1.01), CAN_PHY (JP14.1 U21.6 U22.6)
PC104_I2C_EN: CONNECTOR_BUS (R516.1 U43.5), SAMA7G54_PIO (R517.1)
PC104_I2C_IQR1: CONNECTOR_BUS (H1.43), SAMA7G54_PIO (R297.1)
PC104_I2C_IQR2: CONNECTOR_BUS (H1.45), SAMA7G54_PIO (R276.1)
PC104_RS232_1_RX: CONNECTOR_BUS (H1.19), RS232 (R174.2)
PC104_RS232_1_TX: CONNECTOR_BUS (H1.20), RS232 (R177.2)
PC104_RS232_2_RX: CONNECTOR_BUS (H1.39), RS232 (R448.2)
PC104_RS232_2_TX: CONNECTOR_BUS (H1.41), RS232 (R450.2)
PC104_SPI_IQR1: CONNECTOR_BUS (H1.24), SAMA7G54_PIO (R365.1)
PC104_SPI_IQR2: CONNECTOR_BUS (H1.26), SAMA7G54_PIO (R387.1)
POW_ONOFF_AI: Power (R439.2 R443.1 U34.1), SAMA7G54_PIO (R179.1)
POW_ONOFF_FPGA: SAMA7G54_PIO (R43.1), FPGA_POWER (R305.2 R310.1 U30.1)
RS232_1_UART_RX: SAMA7G54_PIO (R141.1), RS232 (R146.1)
RS232_1_UART_TX: SAMA7G54_PIO (R139.1), RS232 (R176.1)
RS232_2_UART_RX: SAMA7G54_PIO (R129.1), RS232 (R447.1)
RS232_2_UART_TX: SAMA7G54_PIO (R131.1), RS232 (R449.1)
RS422_CONSOLE_SEL: CONNECTOR_IN (Q6.3 R316.1), DEBUG_CONSOLE (R277.2 R278.1 U19.10)
RS422_RX: DEBUG_CONSOLE (U19.3), RS422 (R285.2)
RS422_TX: DEBUG_CONSOLE (U19.13), RS422 (R287.2)
RS_422_RX_N: CONNECTOR_IN (J7.9), RS422 (R236.2 SB3.1 U23.10)
RS_422_RX_P: CONNECTOR_IN (J7.8), RS422 (R236.1 SB2.1 U23.11)
RS_422_TX_N: CONNECTOR_IN (J7.7), RS422 (R237.1 SB3.2 U23.9)
RS_422_TX_P: CONNECTOR_IN (J7.6), RS422 (R237.2 SB2.2 U23.8)
SAM7_MRAM_QSPI_CLK: SAMA7G54_PIO (R77.1), SDCARD_MRAM (U29.6)
SAM7_MRAM_QSPI_IO0: SAMA7G54_PIO (R73.1), SDCARD_MRAM (U29.5)
SAM7_MRAM_QSPI_IO1: SAMA7G54_PIO (R71.1), SDCARD_MRAM (U29.2)
SAM7_MRAM_QSPI_IO2: SAMA7G54_PIO (R69.1), SDCARD_MRAM (U29.3)
SAM7_MRAM_QSPI_IO3: SAMA7G54_PIO (R66.1), SDCARD_MRAM (U29.7)
SAM7_MRAM_QSPI_nCS: SAMA7G54_PIO (R75.1), SDCARD_MRAM (R110.1)
SAM_RTC_I2C_SCL: POWER_MANAGER (R54.2 U6.4), CONNECTOR_BUS (R513.2 U43.2), SAMA7G54_PMIC (R1.2 U1.6 U2.4), SAMA7G54_PIO (R121.1), RTC (R211.2 R412.1 U15.4)
SAM_RTC_I2C_SDA: POWER_MANAGER (R57.2 U6.5), CONNECTOR_BUS (R512.2 U43.3), SAMA7G54_PMIC (R2.2 U1.5 U2.5), SAMA7G54_PIO (R120.1), RTC (R212.2 R411.2 U15.5)
SAMA7_CONF_SPI_FPGA_SEL: SAMA7G54_PIO (R87.1), FPGA_FLASH_EEPROM (R253.1 U14.1)
SAMA7_CONF_SPI_MCLK: SAMA7G54_PIO (R95.1), FPGA_FLASH_EEPROM (U14.5)
SAMA7_CONF_SPI_MCSN: SAMA7G54_PIO (R96.1), FPGA_FLASH_EEPROM (R251.1 U14.2)
SAMA7_CONF_SPI_MISO/MD1: SAMA7G54_PIO (R98.1), FPGA_FLASH_EEPROM (U14.14)
SAMA7_CONF_SPI_MOSI/MD0: SAMA7G54_PIO (R97.1), FPGA_FLASH_EEPROM (U14.11)
SAMA7_FLASH_SPI_FPGA_SEL: SAMA7G54_PIO (R85.1), FPGA_FLASH_EEPROM (R250.1 U13.1)
SAMA7_FLASH_SPI_MCLK: SAMA7G54_PIO (R56.1), FPGA_FLASH_EEPROM (U13.5)
SAMA7_FLASH_SPI_MCSN: SAMA7G54_PIO (R59.1), FPGA_FLASH_EEPROM (R248.1 U13.2)
SAMA7_FLASH_SPI_MISO/MD1: SAMA7G54_PIO (R53.1), FPGA_FLASH_EEPROM (U13.14)
SAMA7_FLASH_SPI_MOSI/MD0: SAMA7G54_PIO (R50.1), FPGA_FLASH_EEPROM (U13.11)
SD2_CLK: SAMA7G54_PIO (R100.1), SDCARD_MRAM (J1.P5 R144.1 U7.3)
SD2_CMD: SAMA7G54_PIO (R99.1), SDCARD_MRAM (J1.P3 R145.1 U8.6)
SD2_DATA0: SAMA7G54_PIO (R102.1), SDCARD_MRAM (J1.P7 R117.1 U7.6)
SD2_DATA1: SAMA7G54_PIO (R104.1), SDCARD_MRAM (J1.P8 R114.1 U7.1)
SD2_DATA2: SAMA7G54_PIO (R106.1), SDCARD_MRAM (J1.P1 R134.1 U8.3)
SD2_DATA3: SAMA7G54_PIO (R109.1), SDCARD_MRAM (J1.P2 R136.1 U8.4)
SD2_nCD: SAMA7G54_PIO (R112.1), SDCARD_MRAM (J1.P9 R113.1)
SHDN: SAMA7G54_PMIC (R5.1), SAMA7G54_MPU (U3.R9)
SOM_CAM_I2C_EN1: SAMA7G54_PIO (R293.1), MIPI_CSI (R479.1 U38.5)
SOM_CAM_I2C_EN2: SAMA7G54_PIO (R295.1), MIPI_CSI (R484.1 U39.5)
SOM_CAM_MIPI_SEL: SAMA7G54_PIO (R292.1), MIPI_CSI (R464.2 U37.13)
SOM_EMMC_nRST: SAMA7G54_PIO (R46.1), eMMC (R171.1 U5.M5)
SOM_RS422_DE: SAMA7G54_PIO (R150.1), RS422 (R238.2 R286.2)
SOM_RS422_~{RE}: SAMA7G54_PIO (R40.1), RS422 (R234.1 R284.2)
SOM_SDMMC0_CD_PA14: SAMA7G54_PIO (R76.1), eMMC (R173.1)
SOM_SDMMC0_OUT_CK: SAMA7G54_PIO (R41.1), eMMC (R170.1 U5.P6)
SOM_SDMMC0_OUT_CMD: SAMA7G54_PIO (R44.1), eMMC (R169.1 U5.P5)
SOM_SDMMC0_OUT_D0: SAMA7G54_PIO (R49.1), eMMC (R168.1 U5.K2)
SOM_SDMMC0_OUT_D1: SAMA7G54_PIO (R52.1), eMMC (R167.1 U5.N2)
SOM_SDMMC0_OUT_D2: SAMA7G54_PIO (R55.1), eMMC (R166.1 U5.K3)
SOM_SDMMC0_OUT_D3: SAMA7G54_PIO (R58.1), eMMC (R165.1 U5.N3)
SOM_SDMMC0_OUT_D4: SAMA7G54_PIO (R61.1), eMMC (R164.1 U5.N8)
SOM_SDMMC0_OUT_D5: SAMA7G54_PIO (R62.1), eMMC (R163.1 U5.K8)
SOM_SDMMC0_OUT_D6: SAMA7G54_PIO (R65.1), eMMC (R162.1 U5.N9)
SOM_SDMMC0_OUT_D7: SAMA7G54_PIO (R68.1), eMMC (R161.1 U5.K9)
SOM_SDMMC0_OUT_DS: SAMA7G54_PIO (R70.1), eMMC (U5.K5)
SOM_STATUS_LED_1: SAMA7G54_PIO (R74.1), BUTTON_LED (R231.2)
SOM_STATUS_LED_2: SAMA7G54_PIO (R143.1), BUTTON_LED (R230.2)
SOM_STATUS_LED_3: SAMA7G54_PIO (R63.1), BUTTON_LED (R232.2)
SOM_USB_SW_nOE: SAMA7G54_PIO (R182.1), USB_CAMERA (R421.2 U32.15)
SOM_USB_SW_SEL0: SAMA7G54_PIO (R175.1), USB_CAMERA (R426.1 U32.6)
SOM_USB_SW_SEL1: SAMA7G54_PIO (R178.1), USB_CAMERA (R425.1 U32.5)
SOM_USER_BUTTON_PA12: SAMA7G54_MPU (R39.1), SAMA7G54_PIO (R72.1)
USB_1_nFAULT: SAMA7G54_PIO (R389.1), USB_CAMERA (R504.2 U20.2)
USB_1_PWR_EN: SAMA7G54_PIO (R86.1), USB_CAMERA (R291.1 U20.1)
USB_2_nFAULT: SAMA7G54_PIO (R501.1), USB_CAMERA (R505.2 U20.3)
USB_2_PWR_EN: SAMA7G54_PIO (R180.1), USB_CAMERA (R290.1 U20.4)
USB_3_nFAULT: SAMA7G54_PIO (R502.1), USB_CAMERA (R506.2 U10.2)
USB_3_PWR_EN: SAMA7G54_PIO (R296.1), USB_CAMERA (R417.1 U10.1)
USB_4_nFAULT: SAMA7G54_PIO (R503.1), USB_CAMERA (R507.2 U10.3)
USB_4_PWR_EN: SAMA7G54_PIO (R92.1), USB_CAMERA (R416.1 U10.4)
WKUP: SAMA7G54_PMIC (R9.1 U1.7), SAMA7G54_MPU (U3.AA15)